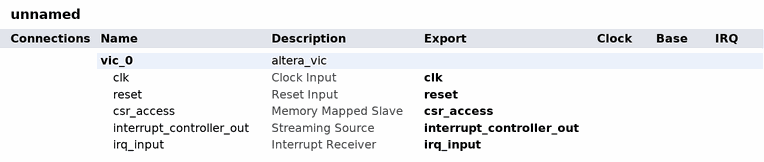
[diagram p0: system contents]
# Platform Designer (Qsys) system unnamed, Cyclone V 5CSEBA6U23I7
# Parameters at their usual value, and those the tool derives, are not listed.
package require -exact qsys 21.1
create_system unnamed
set_project_property DEVICE_FAMILY {Cyclone V}
set_project_property DEVICE 5CSEBA6U23I7

add_instance vic_0 altera_vic 21.1
set_instance_property vic_0 AUTO_EXPORT true
set_instance_parameter_value vic_0 DAISY_CHAIN_ENABLE 0
set_instance_parameter_value vic_0 INTERRUPT_LATENCY_CYCLES 2
set_instance_parameter_value vic_0 NUMBER_OF_INT_PORTS 8
set_instance_parameter_value vic_0 OVERRIDE_INTERRUPT_LATENCY false
set_instance_parameter_value vic_0 RIL_WIDTH 4

# exported interfaces
add_interface clk clock sink
set_interface_property clk EXPORT_OF vic_0.clk
add_interface csr_access avalon slave
set_interface_property csr_access EXPORT_OF vic_0.csr_access
add_interface interrupt_controller_out avalon_streaming source
set_interface_property interrupt_controller_out EXPORT_OF vic_0.interrupt_controller_out
add_interface irq_input interrupt receiver
set_interface_property irq_input EXPORT_OF vic_0.irq_input
add_interface reset reset sink
set_interface_property reset EXPORT_OF vic_0.reset

set_interconnect_requirement {$system} qsys_mm.clockCrossingAdapter HANDSHAKE
set_interconnect_requirement {$system} qsys_mm.enableEccProtection FALSE
set_interconnect_requirement {$system} qsys_mm.insertDefaultSlave FALSE
set_interconnect_requirement {$system} qsys_mm.maxAdditionalLatency 1

save_system unnamed.qsys
